# EAGLE schematic Arduino Mega SRAM Tester (EAGLE 9.5.2)
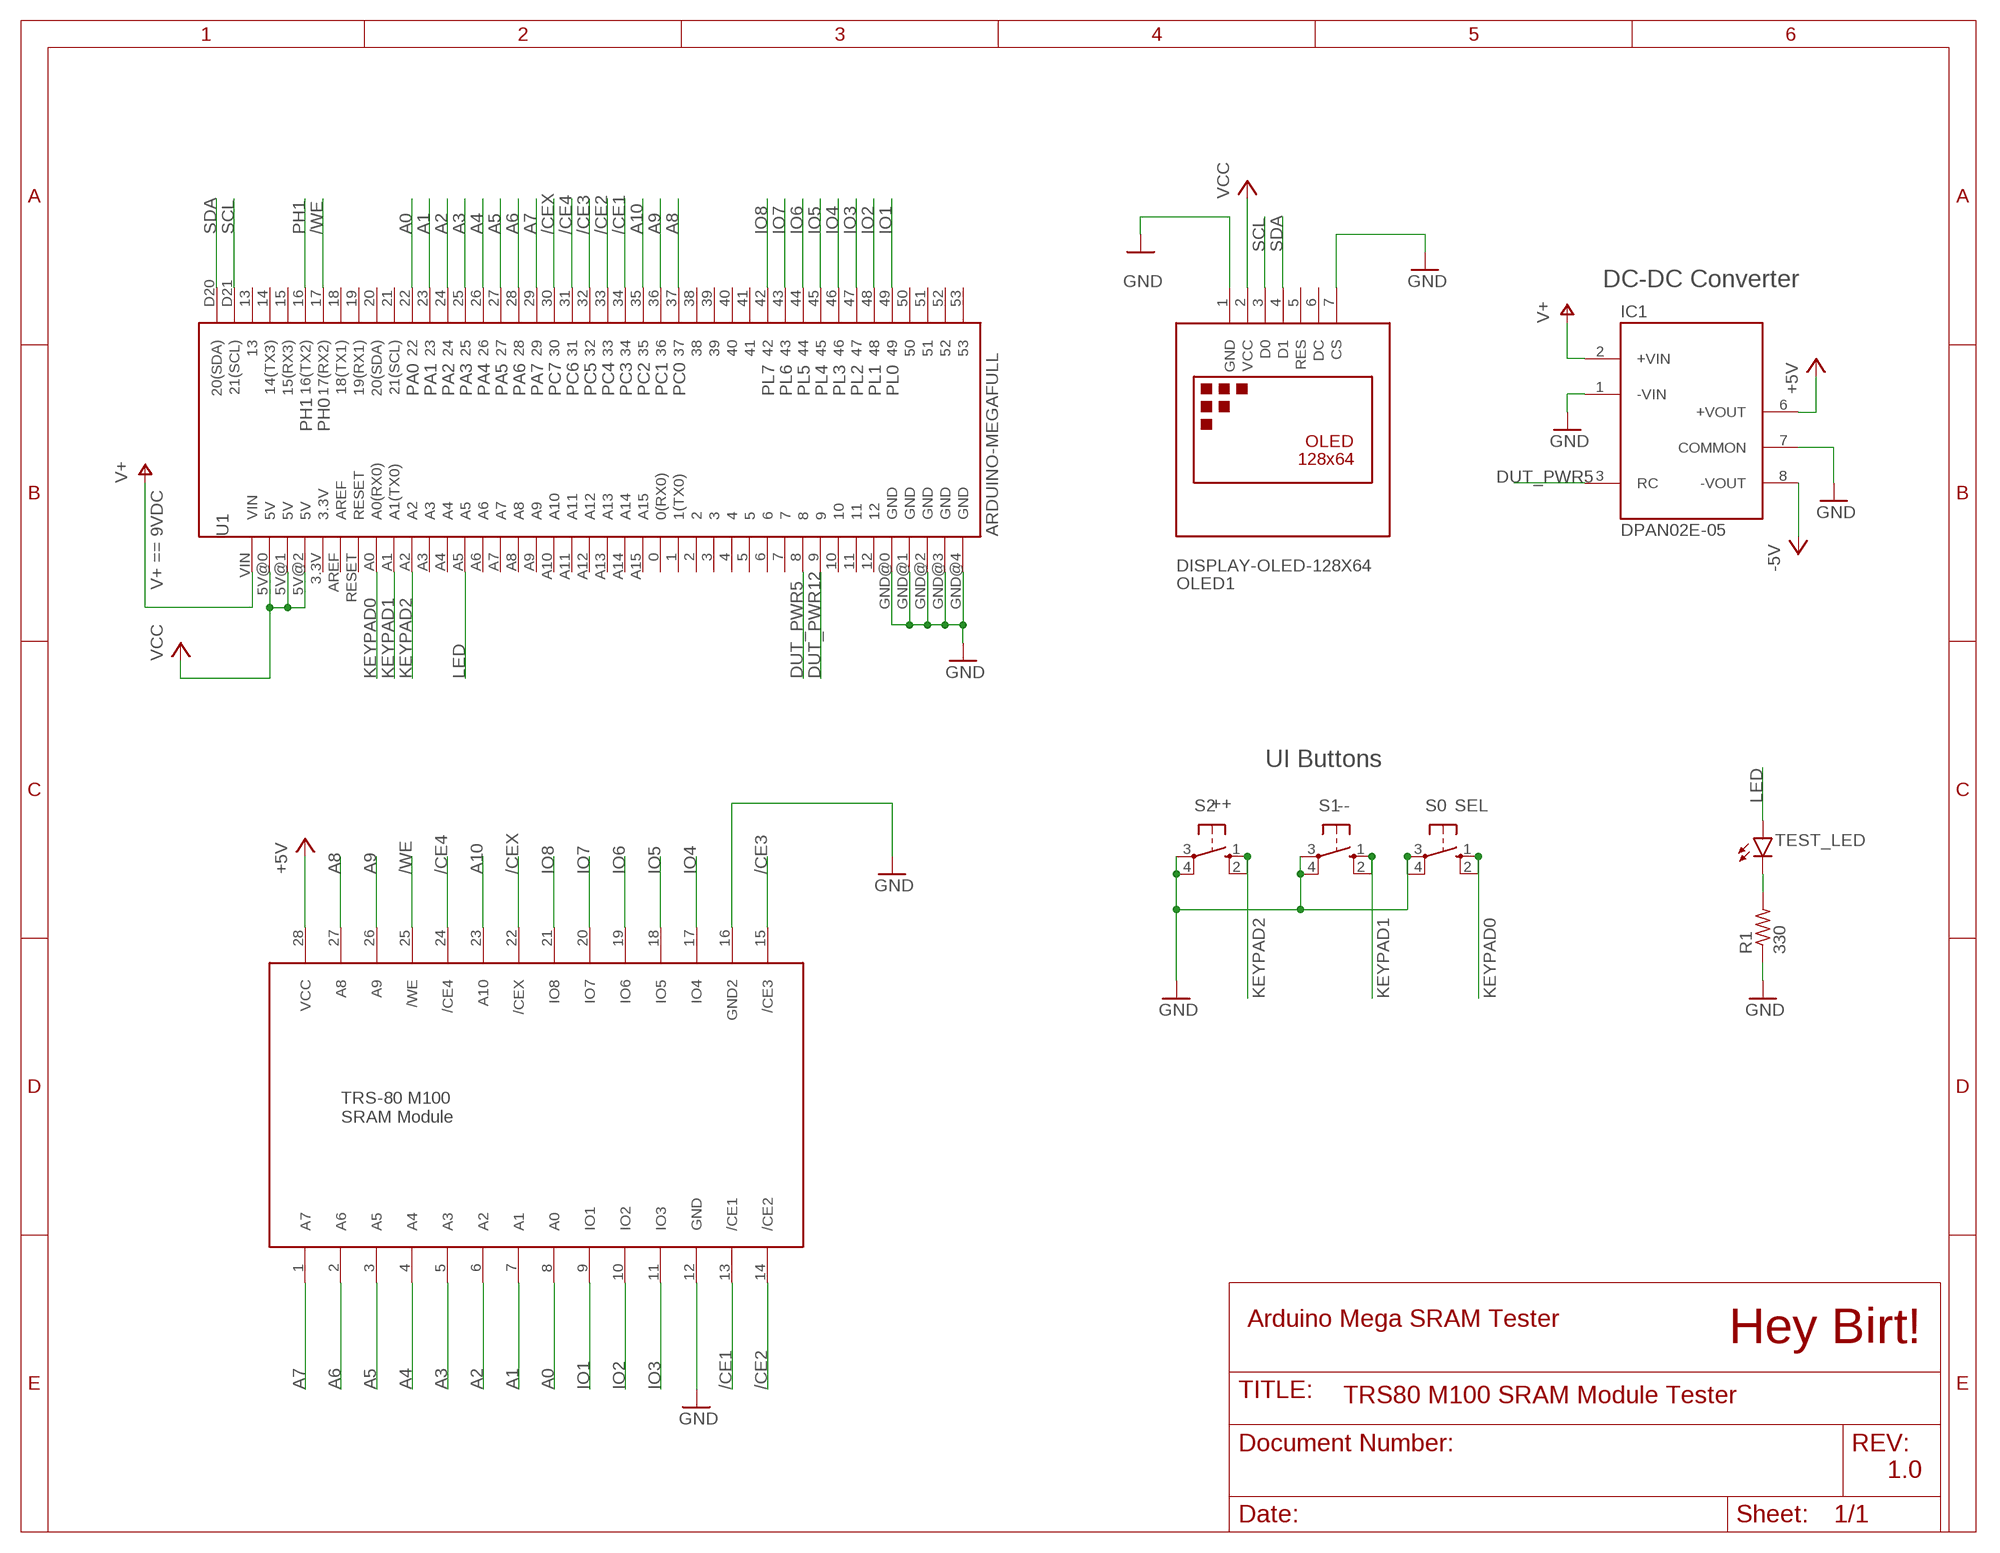
[diagram p0: schematic, sheet 1]

## Parts
IC1  DPAN02E-05  DPAN02  [SIP7]
LED1  TEST_LED  LED3MM  [LED3MM]
OLED1  DISPLAY-OLED-128X64  [DISPLAY-OLED-128X64]
R1  330  R-US_0411/15  [0411/15]
S0  SEL  10-XX  [B3F-10XX]
S1  --  10-XX  [B3F-10XX]
S2  ++  10-XX  [B3F-10XX]
U1  ARDUINO-MEGAFULL  [ARDUINO_MEGA]
U$2  M100_SRAMDIL0.7  [DIL28-6]

## Nets
+5V: IC1.6(+VOUT) U$2.28(VCC)
-5V: IC1.8(-VOUT)
/CE1: U1.34 U$2.13(/CE1)
/CE2: U1.33 U$2.14(/CE2)
/CE3: U1.32 U$2.15(/CE3)
/CE4: U1.31 U$2.24(/CE4)
/CEX: U1.30 U$2.22(/CEX)
/WE: U1.17(17(RX2)) U$2.25(/WE)
A0: U1.22 U$2.8(A0)
A1: U1.23 U$2.7(A1)
A2: U1.24 U$2.6(A2)
A3: U1.25 U$2.5(A3)
A4: U1.26 U$2.4(A4)
A5: U1.27 U$2.3(A5)
A6: U1.28 U$2.2(A6)
A7: U1.29 U$2.1(A7)
A8: U1.37 U$2.27(A8)
A9: U1.36 U$2.26(A9)
A10: U1.35 U$2.23(A10)
DUT_PWR5: IC1.3(RC) U1.8
DUT_PWR12: U1.9
GND: IC1.1(-VIN) IC1.7(COMMON) OLED1.1(GND) OLED1.7(CS) R1.1 S0.3(P) S0.4(P1) S1.3(P) S1.4(P1) S2.3(P) S2.4(P1) U1.GND@0(GND) U1.GND@1(GND) U1.GND@2(GND) U1.GND@3(GND) U1.GND@4(GND) U$2.12(GND) U$2.16(GND2)
IO1: U1.49 U$2.9(IO1)
IO2: U1.48 U$2.10(IO2)
IO3: U1.47 U$2.11(IO3)
IO4: U1.46 U$2.17(IO4)
IO5: U1.45 U$2.18(IO5)
IO6: U1.44 U$2.19(IO6)
IO7: U1.43 U$2.20(IO7)
IO8: U1.42 U$2.21(IO8)
KEYPAD0: S0.1(S) S0.2(S1) U1.A0(A0(RX0))
KEYPAD1: S1.1(S) S1.2(S1) U1.A1(A1(TX0))
KEYPAD2: S2.1(S) S2.2(S1) U1.A2
LED: LED1.A U1.A5
N$1: LED1.K(C) R1.2
PH1: U1.16(16(TX2))
SCL: OLED1.3(D0) U1.D21(21(SCL))
SDA: OLED1.4(D1) U1.D20(20(SDA))
V+: IC1.2(+VIN) U1.VIN
VCC: OLED1.2(VCC) U1.5V@0(5V) U1.5V@1(5V) U1.5V@2(5V)
Unconnected: OLED1.5(RES) OLED1.6(DC) U1.0(0(RX0)) U1.1(1(TX0)) U1.2 U1.3 U1.3.3V U1.4 U1.5 U1.6 U1.7 U1.10 U1.11 U1.12 U1.13 U1.14(14(TX3)) U1.15(15(RX3)) U1.18(18(TX1)) U1.19(19(RX1)) U1.20(20(SDA)) U1.21(21(SCL)) U1.38 U1.39 U1.40 U1.41 U1.50 U1.51 U1.52 U1.53 U1.A3 U1.A4 U1.A6 U1.A7 U1.A8 U1.A9 U1.A10 U1.A11 U1.A12 U1.A13 U1.A14 U1.A15 U1.AREF U1.RESET

## Notes on the sheet
- DC-DC Converter
- PA0 | PA1 | PA2 | PA3 | PA4 | PA5 | PA6 | PA7 | PC7 | PC6 | PC5 | PC4 | PC3 | PC2 | PC1 | PC0 | PL7 | PL6 | PL5 | PL4 | PL3 | PL2 | PL1 | PL0
- PH1 | PH0
- V+ == 9VDC
- UI Buttons
- TRS-80 M100
  SRAM Module
- Hey Birt!
- TRS80 M100 SRAM Module Tester
- 1.0

## Library data of the parts
IC1 = MW DPAN02:DPAN02
LED1 = led:LED: LED OSRAM: - CHIPLED LG R971, LG N971, LY N971, LG Q971, LY Q971, LO R971, LY R971 LH N974, LH R974 LS Q976, LO Q976, LY Q976 LO Q996 - Hyper CHIPLED LW Q18S LB Q993, LB Q99A, LB R99A - SideLED LS A670, LO A670, LY A670, LG A670, LP A670 LB A673, LV A673, LT A673, LW A673 LH A674 LY A675 LS A676, LA A676, LO A676, LY A676, LW A676 LS A679, LY A679, LG A679 - Hyper Micro SIDELED® LS Y876, LA Y876, LO Y876, LY Y876 LT Y87S - SmartLED LW L88C, LW L88S LB L89C, LB L89S, LG L890 LS L89K, LO L89K, LY L89K LS L896, LA L896, LO L896, LY L896 - TOPLED LS T670, LO T670, LY T670, LG T670, LP T670 LSG T670, LSP T670, LSY T670, LOP T670, LYG T670 LG T671, LOG T671, LSG T671 LB T673, LV T673, LT T673, LW T673 LH T674 LS T676, LA T676, LO T676, LY T676, LB T676, LH T676, LSB T676, LW T676 LB T67C, LV T67C, LT T67C, LS T67K, LO T67K, LY T67K, LW E67C LS E67B, LA E67B, LO E67B, LY E67B, LB E67C, LV E67C, LT E67C LW T67C LS T679, LY T679, LG T679 LS T770, LO T770, LY T770, LG T770, LP T770 LB T773, LV T773, LT T773, LW T773 LH T774 LS E675, LA E675, LY E675, LS T675 LS T776, LA T776, LO T776, LY T776, LB T776 LHGB T686 LT T68C, LB T68C - Hyper Mini TOPLED® LB M676 - Mini TOPLED Santana® LG M470 LS M47K, LO M47K, LY M47K Source: http://www.osram.convergy.de LUXEON: - LUMILED® LXK2-PW12-R00, LXK2-PW12-S00, LXK2-PW14-U00, LXK2-PW14-V00 LXK2-PM12-R00, LXK2-PM12-S00, LXK2-PM14-U00 LXK2-PE12-Q00, LXK2-PE12-R00, LXK2-PE12-S00, LXK2-PE14-T00, LXK2-PE14-U00 LXK2-PB12-K00, LXK2-PB12-L00, LXK2-PB12-M00, LXK2-PB14-N00, LXK2-PB14-P00, LXK2-PB14-Q00 LXK2-PR12-L00, LXK2-PR12-M00, LXK2-PR14-Q00, LXK2-PR14-R00 LXK2-PD12-Q00, LXK2-PD12-R00, LXK2-PD12-S00 LXK2-PH12-R00, LXK2-PH12-S00 LXK2-PL12-P00, LXK2-PL12-Q00, LXK2-PL12-R00 Source: www.luxeon.com KINGBRIGHT: KA-3528ASYC Source: www.kingbright.com
OLED1 = Soigeneris:DISPLAY-OLED-128X64: 128x64 Dot Matrix OLED Module based on SSD1306 chip Variant with SPI interface More details available here: http://www.instructables.com/id/How-to-use-OLED-display-arduino-module/ SSD1306 datasheet: https://cdn-shop.adafruit.com/datasheets/SSD1306.pdf Click here to find device on ebay.com <http://www.ebay.com/sch/oled+display+128x64> Note: There are two variants: I2C and SPI. Search for the proper version.
R1 = rcl:R-US_: RESISTOR, American symbol; SPICEPREFIX: R
S0 S1 S2 = switch-omron:10-XX: OMRON SWITCH; MPN: B3F-1000; OC_FARNELL: 176432; OC_NEWARK: 36M3542
U1 = SparkFun-Boards:ARDUINO-MEGA: Arduino Mega board footprint
U$2 = Soigeneris:M100_SRAM